# Altium schematic sheet camera.SchDoc
size A3; PageSetup: Record=PageOptions|CenterHorizontal=True|CenterVertical=True|PrintScale=0.71|XCorrection=1.00|YCorrection=1.00|PrintKind=2|BorderSize=5000000|LeftOffset=0|BottomOffset=0|Orientation=2|PaperLength=1000|PaperWidth=1000|Scale=100|PaperSource=7|PrintQuality=-4|MediaType=1|DitherType=10|PaperKind=A4|PrintScaleMode=1
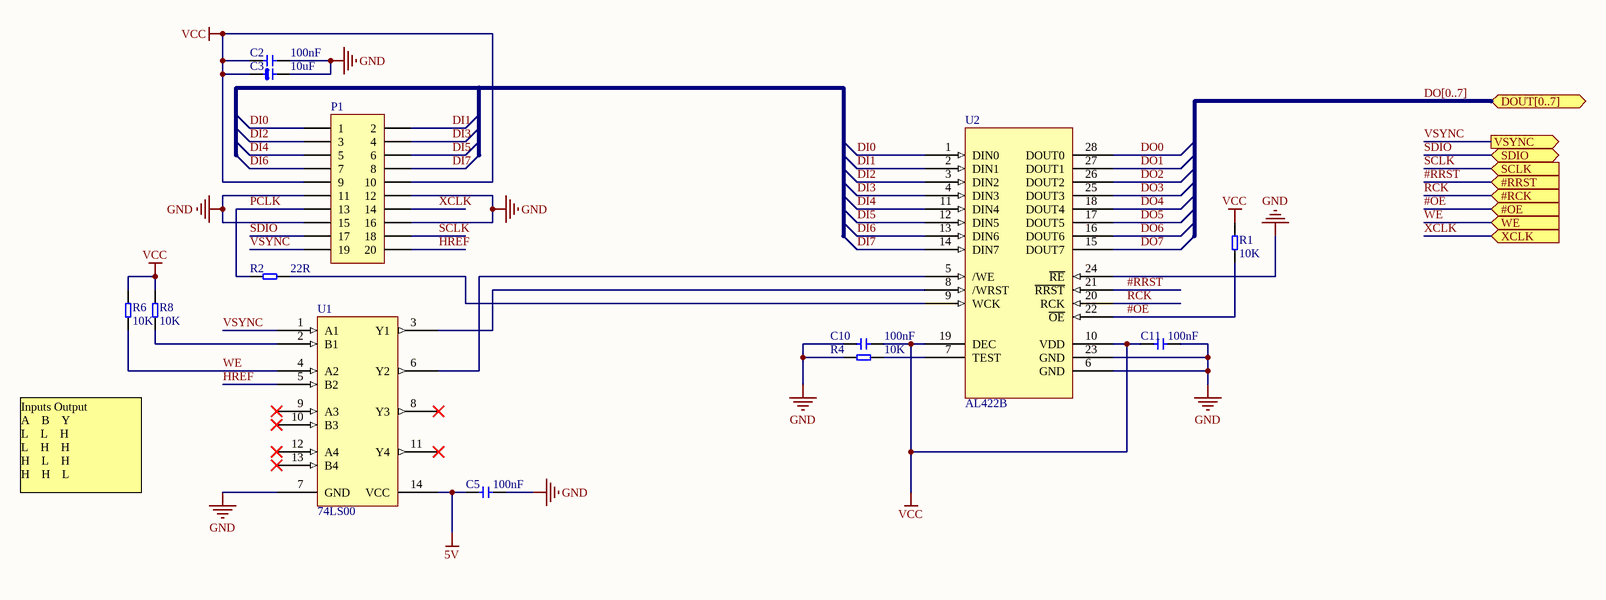
[diagram p0: camera.SchDoc]

## Parts
C2  value 100nF  [SMD_0805]  (hidden comment: Cap)
C3  value 10uF  [SMD_0805_POL]  (hidden comment: Cap)
C5  value 100nF  [SMD_0805]  (hidden comment: Cap)
C10  value 100nF  [SMD_0805]  (hidden comment: Cap)
C11  value 100nF  [SMD_0805]  (hidden comment: Cap)
P1  Header 10 * 2  [HDR_2×10]  (value not drawn)
R1  value 10K  [SMD_0805]  (hidden comment: Res)
R2  value 22R  [SMD_0805]  (hidden comment: Res)
R4  value 10K  [SMD_0805]  (hidden comment: Res)
R6  value 10K  [SMD_0805]  (hidden comment: Res)
R8  value 10K  [SMD_0805]  (hidden comment: Res)
U1  74LS00  [SOIC_14]
U2  AL422B  [SOP_28]

## Ports
#OE (in), #RCK (in), #RRST (in), DOUT[0..7] (bidir), SCLK (in), SDIO (bidir), VSYNC (out), WE (in), XCLK (in)

## Nets
5V: C5.1 U1.14(VCC)
GND: C2.2 C3.2 C5.2 C10.1 C11.2 P1.11 P1.12 P1.15 P1.16 R4.1 U1.7(GND) U2.6(GND) U2.23(GND) U2.24(~{RE})
VCC: C2.1 C3.1 C10.2 C11.1 P1.9 P1.10 R1.2 R6.2 R8.2 U2.10(VDD) U2.19(DEC)
#OE: R1.1 U2.22(~{OE}) ; port #OE
#RRST: U2.21(~{RRST}) ; port #RRST
DI0: P1.1 U2.1(DIN0)
DI1: P1.2 U2.2(DIN1)
DI2: P1.3 U2.3(DIN2)
DI3: P1.4 U2.4(DIN3)
DI4: P1.5 U2.11(DIN4)
DI5: P1.6 U2.12(DIN5)
DI6: P1.7 U2.13(DIN6)
DI7: P1.8 U2.14(DIN7)
DO0: U2.28(DOUT0)
DO1: U2.27(DOUT1)
DO2: U2.26(DOUT2)
DO3: U2.25(DOUT3)
DO4: U2.18(DOUT4)
DO5: U2.17(DOUT5)
DO6: U2.16(DOUT6)
DO7: U2.15(DOUT7)
HREF: P1.20 U1.5(B2)
PCLK: P1.13 R2.1
RCK: U2.20(RCK) ; port #RCK
SCLK: P1.18 ; port SCLK
SDIO: P1.17 ; port SDIO
VSYNC: P1.19 U1.1(A1) ; port VSYNC
WE: R6.1 U1.4(A2) ; port WE
XCLK: P1.14 ; port XCLK
NetR2_2: R2.2 U2.9(WCK)
NetR4_2: R4.2 U2.7(TEST)
NetR8_1: R8.1 U1.2(B1)
NetU1_3: U1.3(Y1) U2.8(/WRST)
NetU1_6: U1.6(Y2) U2.5(/WE)

Not connected (* = marked no-connect by the designer): U1 8(Y3)* 9(A3)* 10(B3)* 11(Y4)* 12(A4)* 13(B4)*

## Buses and harness runs
bus DO[0..7] = port DOUT[0..7]

## Notes on the sheet
- Inputs Output
  A    B    Y
  L    L    H
  L    H    H
  H    L    H
  H    H    L

## Library data of the parts
C2 C5 C10 C11 = Cap: Capacitor; Published: 8-Jun-2000; LatestRevisionDate: 17-Jul-2002; LatestRevisionNote: Re-released for DXP Platform.; PackageReference: RAD-0.3; Publisher: Altium Limited
C3 = Cap Pol: Polarized Capacitor (Surface Mount); Published: 8-Jun-2000; LatestRevisionDate: 17-Jul-2002; LatestRevisionNote: Re-released for DXP Platform.; PackageReference: C0805; Publisher: Altium Limited
P1 = Header 10 * 2: Header, 10 * 2-Pin; LatestRevisionDate: 17-Jul-2002; LatestRevisionNote: Re-released for DXP Platform.; Publisher: Altium Limited; Value: Header 10 * 2
R1 R2 R4 R6 R8 = Res: Resistor; Published: 8-Jun-2000; LatestRevisionDate: 17-Jul-2002; LatestRevisionNote: Re-released for DXP Platform.; PackageReference: AXIAL-0.3; Publisher: Altium Limited
U1 = 74LS00: Quad 2-Input NAND Gate
U2 = AL422B: Averlogic FIFO 3Mbits